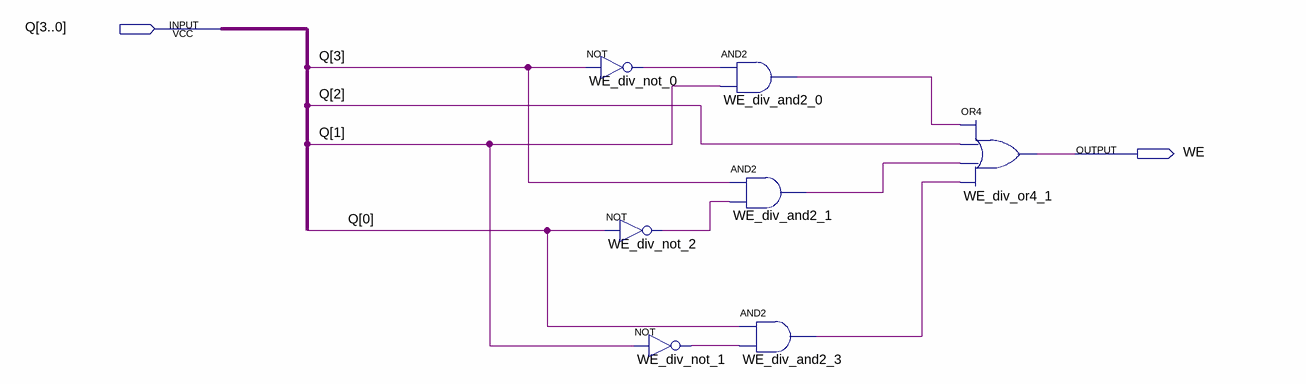
[diagram p0: schematic sheet]
// Quartus schematic WE_Division.bdf as structural Verilog: 7 symbols, 2 pins
module WE_Division (
  input  [3:0] Q,
  output WE
);

  wire WE_div_and2_0_out, WE_div_and2_1_out, WE_div_and2_3_out, WE_div_not_0_out, WE_div_not_1_out,
       WE_div_not_2_out;

  not WE_div_not_0 (WE_div_not_0_out, Q[3]);
  not WE_div_not_2 (WE_div_not_2_out, Q[0]);
  not WE_div_not_1 (WE_div_not_1_out, Q[1]);
  and WE_div_and2_0 (WE_div_and2_0_out, WE_div_not_0_out, Q[1]);
  and WE_div_and2_1 (WE_div_and2_1_out, Q[3], WE_div_not_2_out);
  and WE_div_and2_3 (WE_div_and2_3_out, Q[0], WE_div_not_1_out);
  or WE_div_or4_1 (WE, WE_div_and2_0_out, Q[2], WE_div_and2_1_out, WE_div_and2_3_out);
endmodule
